# EAGLE schematic sub1 (EAGLE 4.13)
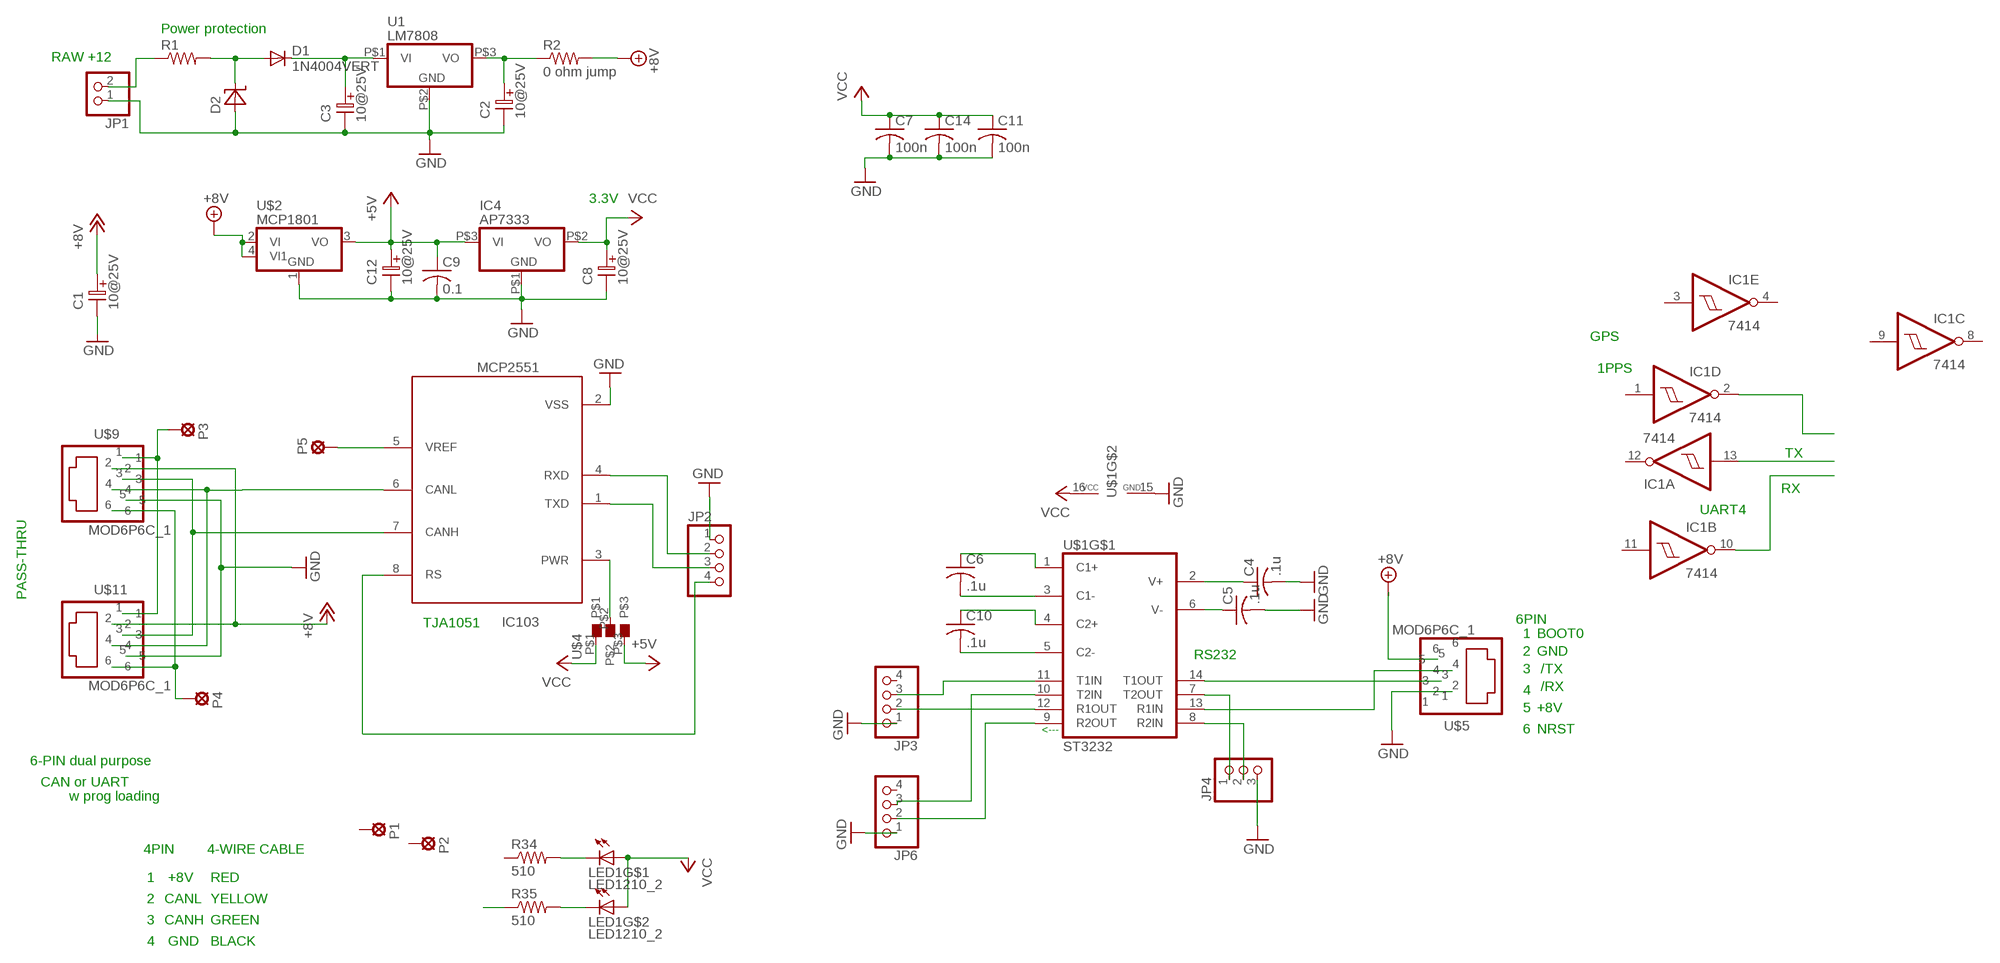
[diagram p0: schematic, sheet 1]

## Parts
C1  10@25V  ELC-2,5L  [ES-2,5L]
C2  10@25V  ELC-2,5L  [ES-2,5L]
C3  10@25V  ELC-2,5L  [ES-2,5L]
C4  .1u  C-USC0805  [C0805]
C5  .1u  C-USC0805  [C0805]
C6  .1u  C-USC0805  [C0805]
C7  100n  C-USC0603  [C0603]
C8  10@25V  ELC-2,5L  [ES-2,5L]
C9  0.1  C-USC0603  [C0603]
C10  .1u  C-USC0805  [C0805]
C11  100n  C-USC0603  [C0603]
C12  10@25V  ELC-2,5L  [ES-2,5L]
C14  100n  C-USC0603  [C0603]
D1  1N4004VERT  [DO41-VERT]
D2  ZDIO-7,5  [D-7,5]
IC1  7414  [TSSOP14]
IC4  AP7333  MCP1702  [SOT-23A]
IC103  MCP2551  [SO-08]
JP1  PINHD-1X2  [1X02]
JP2  PINHD-1X4  [1X04]
JP3  PINHD-1X4  [1X04]
JP4  PINHD-1X3  [1X03]
JP6  PINHD-1X4  [1X04]
LED1  LED1210_2  [CHIP2LED_1210]
P1  PE14  SOLDPAD028  [SOLPAD028]
P2  PE14  SOLDPAD028  [SOLPAD028]
P3  PE14  SOLDPAD028  [SOLPAD028]
P4  PE14  SOLDPAD028  [SOLPAD028]
P5  PE14  SOLDPAD028  [SOLPAD028]
R1  R-US_0207/2V  [0207/2V]
R2  0 ohm jump  R-US_R0603  [R0603]
R34  510  R-US_R0603  [R0603]
R35  510  R-US_R0603  [R0603]
U1  LM7808  78XXTVERT  [TO-220V1]
U$1  ST3232  [SO16]
U$2  MCP1801  [SOT-89]
U$4  SMD-3  [SMD_3]
U$5  MOD6P6C_1  [MOD6P6C_1]
U$9  MOD6P6C_1  [MOD6P6C_1]
U$11  MOD6P6C_1  [MOD6P6C_1]

## Nets
+5V: C9.1 C12.1 IC4.P$3(VI) U$2.3(VO) U$4.P$3
+8V: R2.2 U$2.2(VI) U$2.4(VI1) U$5.5
+12V: C1.1 U$9.2 U$11.2 ; supply symbol labelled +8V
C1+: C6.1 U$1.1(C1+)
C1-: C6.2 U$1.3(C1-)
C2+: C10.1 U$1.4(C2+)
C2-: C10.2 U$1.5(C2-)
CANH: IC103.7(CANH) U$9.3 U$11.3
CANL: IC103.6(CANL) U$9.4 U$11.4
GND: C1.2 C2.2 C3.2 C4.2 C5.2 C7.2 C8.2 C11.2 C12.2 C14.2 D2.1(A) IC4.P$1(GND) IC103.2(VSS) JP1.1 JP2.1 JP3.1 JP4.3 JP6.1 U1.P$2(GND) U$1.15(GND) U$2.1(GND) U$5.2 U$9.5 U$11.5
N$1: P3.MP U$9.1 U$11.1
N$2: P4.MP U$9.6 U$11.6
N$3: IC103.1(TXD) JP2.3
N$4: IC1.13(A:I)
N$5: IC1.10(B:O)
N$6: IC1.2(D:O)
N$7: IC103.4(RXD) JP2.2
N$8: IC103.3(PWR) U$4.P$2
N$9: D1.A D2.2(K) R1.2
N$11: JP6.2 U$1.9(R2OUT)
N$12: JP1.2 R1.1
N$13: IC103.5(VREF) P5.MP
PA9_USART1_TX: JP3.3 U$1.11(T1IN)
PA10_USART1_RX: JP3.2 U$1.12(R1OUT)
PB7_CAN_RS: IC103.8(RS) JP2.4
PB12_LED1: LED1.C R34.2
PB13_LED: R35.1
PB13_LED2: LED1.C1(C) R35.2
PC10_UART4_TX: JP6.3 U$1.10(T2IN)
RS232_R1IN_USART1_RX: U$1.13(R1IN) U$5.4
T1OUT_USART1_TX: U$1.14(T1OUT) U$5.3
T2OUT_UART_TX: JP4.1 U$1.7(T2OUT)
VCC: C7.1 C8.1 C11.1 C14.1 IC4.P$2(VO) LED1.A LED1.A1(A) U$1.16(VCC) U$4.P$1
VI: C3.1 D1.C U1.P$1(VI)
VO: C2.1 R2.1 U1.P$3(VO)
VRS232+: C4.1 U$1.2(V+)
VRS232-: C5.1 U$1.6(V-)
|RS232_R2IN_UART_RX: JP4.2 U$1.8(R2IN)
Unconnected: C9.2 IC1.1(D:I) IC1.3(E:I) IC1.4(E:O) IC1.5(F:I) IC1.6(F:O) IC1.8(C:O) IC1.9(C:I) IC1.11(B:I) IC1.12(A:O) JP3.4 JP6.4 P1.MP P2.MP R34.1 U$5.1 U$5.6

## Notes on the sheet
- Power protection
- RAW +12
- 3.3V
- GPS
- 1PPS
- TX
- RX
- UART4
- PASS-THRU
- TJA1051 | 6PIN
- 1 | BOOT0
- RS232 | 2 | GND
- 3 | /TX
- 4 | /RX
- 5 | +8V
- <--- | 6 | NRST
- 6-PIN dual purpose
- CAN or UART
- w prog loading
- 4PIN | 4-WIRE CABLE
- 1 | +8V | RED
- 2 | CANL | YELLOW
- 3 | CANH | GREEN
- 4 | GND | BLACK

## Power pins joined to a net without a drawn wire
GND: IC1.7(P:GND)
VCC: IC1.14(P:VCC)

## Library data of the parts
C1-C3 C8 C12 = DEH:ELC-2,5L
C4-C7 C9-C11 C14 = rcl:C-US: CAPACITOR, American symbol
D1 = diode-1:1N4004: DIODE general purpose rectifier, 1 A
D2 = DEH:ZDIO-7,5
IC1 = 74xx-us:74*14: Hex schmitt trigger INVERTER
IC4 = linear:MCP1702
IC103 = texas:MCP2551
JP1 = pinhead:PINHD-1X2: PIN HEADER
JP2 JP3 JP6 = pinhead:PINHD-1X4: PIN HEADER
JP4 = pinhead:PINHD-1X3: PIN HEADER
LED1 = led:LED1210_2
P1-P5 = solpad:SOLDPAD028
R1 R2 R34 R35 = rcl:R-US_: RESISTOR, American symbol
U1 = DEH:78XXTVERT
U$1 = maxim:ST3232
U$2 = linear:MCP1801
U$4 = solpad:SMD-3
U$5 U$9 U$11 = DEH:MOD6P6C_1